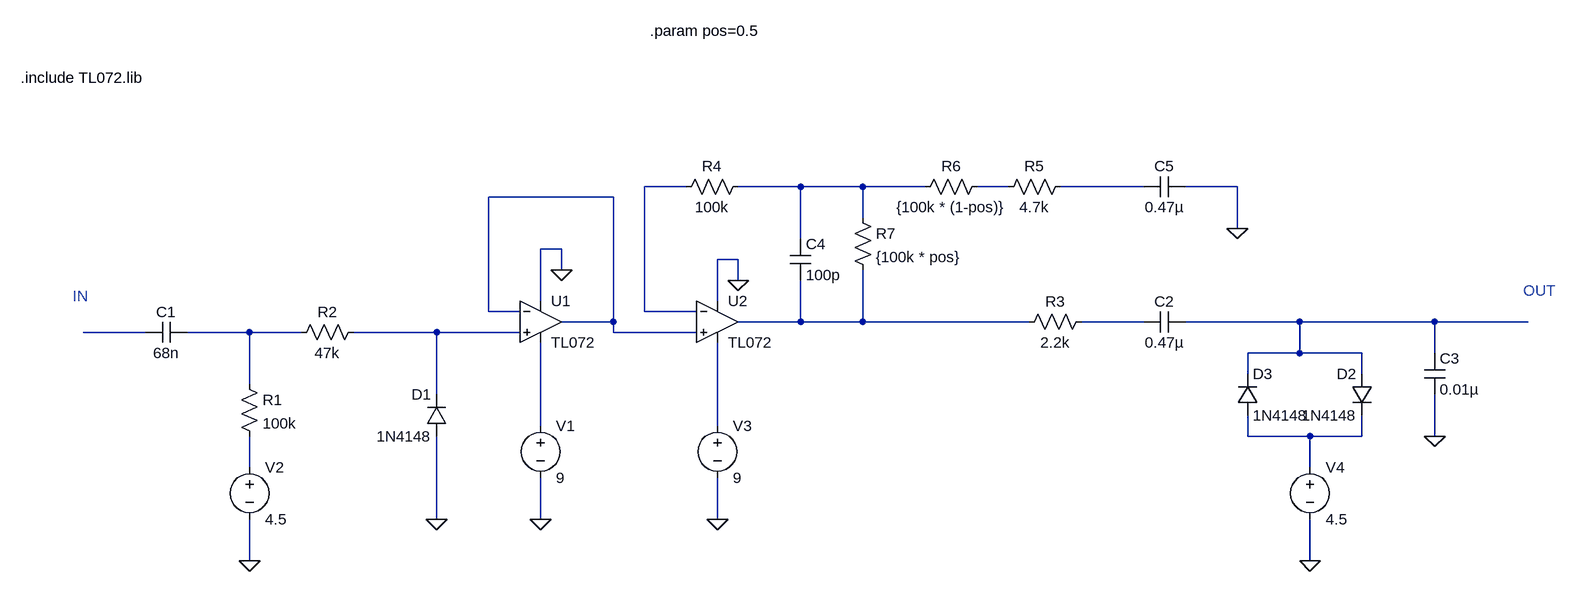
[diagram p0: schematic amplify_stage.asc]
amplify_stage.asc, the LTspice schematic file:
Version 4.1
SHEET 1 2392 680
WIRE 896 -80 832 -80
WIRE 1072 -80 976 -80
WIRE 1168 -80 1072 -80
WIRE 1264 -80 1168 -80
WIRE 1392 -80 1344 -80
WIRE 1600 -80 1472 -80
WIRE 1744 -80 1664 -80
WIRE 784 -64 592 -64
WIRE 1168 -32 1168 -80
WIRE 1744 -16 1744 -80
WIRE 1072 0 1072 -80
WIRE 704 16 672 16
WIRE 976 32 944 32
WIRE 704 48 704 16
WIRE 976 64 976 32
WIRE 672 96 672 16
WIRE 944 96 944 32
WIRE 592 112 592 -64
WIRE 640 112 592 112
WIRE 832 112 832 -80
WIRE 912 112 832 112
WIRE 784 128 784 -64
WIRE 784 128 704 128
WIRE 1072 128 1072 64
WIRE 1072 128 976 128
WIRE 1168 128 1168 48
WIRE 1168 128 1072 128
WIRE 1424 128 1168 128
WIRE 1600 128 1504 128
WIRE 1840 128 1664 128
WIRE 2048 128 1840 128
WIRE 2192 128 2048 128
WIRE 64 144 -32 144
WIRE 224 144 128 144
WIRE 304 144 224 144
WIRE 512 144 384 144
WIRE 640 144 512 144
WIRE 784 144 784 128
WIRE 912 144 784 144
WIRE 1840 176 1840 128
WIRE 1840 176 1760 176
WIRE 1936 176 1840 176
WIRE 2048 176 2048 128
WIRE 1760 208 1760 176
WIRE 1936 208 1936 176
WIRE 224 224 224 144
WIRE 512 240 512 144
WIRE 672 288 672 160
WIRE 944 288 944 160
WIRE 1760 304 1760 272
WIRE 1856 304 1760 304
WIRE 1936 304 1936 272
WIRE 1936 304 1856 304
WIRE 2048 304 2048 240
WIRE 224 352 224 304
WIRE 1856 352 1856 304
WIRE 512 432 512 304
WIRE 672 432 672 368
WIRE 944 432 944 368
WIRE 224 496 224 432
WIRE 1856 496 1856 432
FLAG 672 432 0
FLAG 512 432 0
FLAG 224 496 0
FLAG 704 48 0
FLAG 976 64 0
FLAG 944 432 0
FLAG 1856 496 0
FLAG 2048 304 0
FLAG 1744 -16 0
SYMBOL cap 128 128 R90
WINDOW 0 0 32 VBottom 2
WINDOW 3 32 32 VTop 2
SYMATTR InstName C1
SYMATTR Value 68n
SYMBOL res 208 208 R0
SYMATTR InstName R1
SYMATTR Value 100k
SYMBOL res 400 128 R90
WINDOW 0 0 56 VBottom 2
WINDOW 3 32 56 VTop 2
SYMATTR InstName R2
SYMATTR Value 47k
SYMBOL diode 528 304 R180
WINDOW 0 24 64 Left 2
WINDOW 3 24 0 Left 2
SYMATTR InstName D1
SYMATTR Value 1N4148
SYMBOL OpAmps\\opamp2 672 64 R0
SYMATTR InstName U1
SYMATTR Value TL072
SYMATTR SpiceModel TL072
SYMBOL OpAmps\\opamp2 944 64 R0
SYMATTR InstName U2
SYMATTR Value TL072
SYMATTR SpiceModel TL072
SYMBOL res 1520 112 R90
WINDOW 0 0 56 VBottom 2
WINDOW 3 32 56 VTop 2
SYMATTR InstName R3
SYMATTR Value 2.2k
SYMBOL cap 1664 112 R90
WINDOW 0 0 32 VBottom 2
WINDOW 3 32 32 VTop 2
SYMATTR InstName C2
SYMATTR Value 0.47µ
SYMBOL diode 1952 208 M0
SYMATTR InstName D2
SYMATTR Value 1N4148
SYMBOL diode 1744 272 M180
WINDOW 0 24 64 Left 2
WINDOW 3 24 0 Left 2
SYMATTR InstName D3
SYMATTR Value 1N4148
SYMBOL cap 2032 176 R0
SYMATTR InstName C3
SYMATTR Value 0.01µ
SYMBOL res 992 -96 R90
WINDOW 0 0 56 VBottom 2
WINDOW 3 32 56 VTop 2
SYMATTR InstName R4
SYMATTR Value 100k
SYMBOL cap 1056 0 R0
SYMATTR InstName C4
SYMATTR Value 100p
SYMBOL res 1488 -96 R90
WINDOW 0 0 56 VBottom 2
WINDOW 3 32 56 VTop 2
SYMATTR InstName R5
SYMATTR Value 4.7k
SYMBOL cap 1664 -96 R90
WINDOW 0 0 32 VBottom 2
WINDOW 3 32 32 VTop 2
SYMATTR InstName C5
SYMATTR Value 0.47µ
SYMBOL voltage 672 272 R0
WINDOW 123 0 0 Left 0
WINDOW 39 0 0 Left 0
SYMATTR InstName V1
SYMATTR Value 9
SYMBOL voltage 224 336 R0
WINDOW 123 0 0 Left 0
WINDOW 39 0 0 Left 0
SYMATTR InstName V2
SYMATTR Value 4.5
SYMBOL voltage 944 272 R0
WINDOW 123 0 0 Left 0
WINDOW 39 0 0 Left 0
SYMATTR InstName V3
SYMATTR Value 9
SYMBOL voltage 1856 336 R0
WINDOW 123 0 0 Left 0
WINDOW 39 0 0 Left 0
SYMATTR InstName V4
SYMATTR Value 4.5
SYMBOL res 1360 -96 R90
WINDOW 0 0 56 VBottom 2
WINDOW 3 32 56 VTop 2
SYMATTR InstName R6
SYMATTR Value {100k * (1-pos)}
SYMBOL res 1152 -48 R0
SYMATTR InstName R7
SYMATTR Value {100k * pos}
TEXT -128 -248 Left 2 !.include TL072.lib
TEXT 2184 80 Left 2 ;OUT
TEXT -48 88 Left 2 ;IN
TEXT 840 -320 Left 2 !.param pos=0.5

The netlist it stands for:
* amplify_stage.asc
C1 N010 N009 68n
R1 N010 N015 100k
R2 N011 N010 47k
D1 0 N011 1N4148
X§U1 N011 N005 0 N012 N005 TL072 TL072  ; pins In+ In- V+ V- OUT
X§U2 N005 N001 0 N013 N006 TL072 TL072  ; pins In+ In- V+ V- OUT
R3 N007 N006 2.2k
C2 N008 N007 0.47µ
D2 N008 N014 1N4148
D3 N014 N008 1N4148
C3 N008 0 0.01µ
R4 N002 N001 100k
C4 N002 N006 100p
R5 N004 N003 4.7k
C5 0 N004 0.47µ
V1 N012 0 9
V2 N015 0 4.5
V3 N013 0 9
V4 N014 0 4.5
R6 N003 N002 {100k * (1-pos)}
R7 N002 N006 {100k * pos}
.model D D
.lib standard.dio
.include TL072.lib
* OUT
* IN
.param pos=0.5
.backanno
.end